# Altium schematic sheet Sen_Cos_Acondicionation.SchDoc
size 431 x 279 mm; Organization: ORGANIZATION; Address1: ADDRESS 1; Address2: ADDRESS 2; Address3: ADDRESS 3; Address4: ADDRESS 4; Revision: -; SheetNumber: 16; SheetTotal: 16; ENG_APP_DATE: --/--/--; DSN_APP_DATE: --/--/--; CHK_APP_DATE: --/--/--
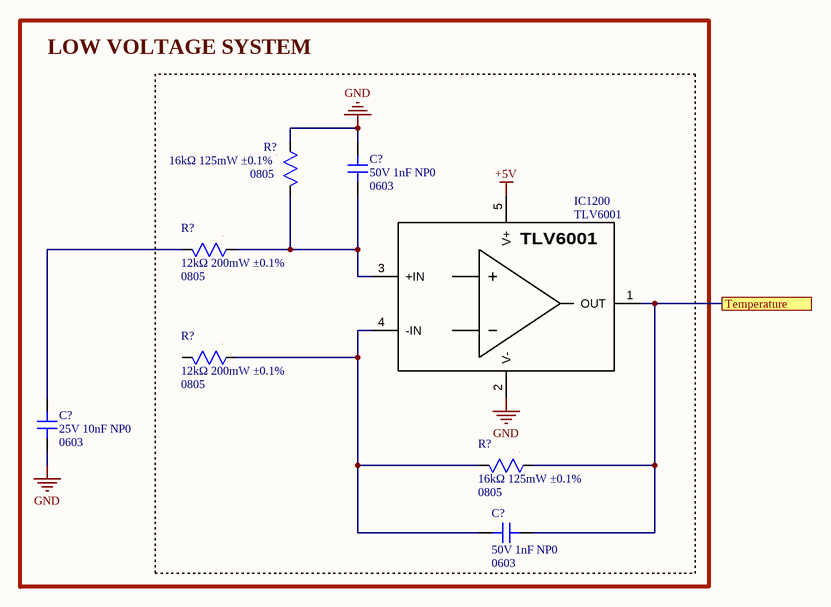
[diagram p0: Sen_Cos_Acondicionation.SchDoc]

## Parts
(Parts that share a designator on the sheet are numbered #1, #2 ... from top to bottom, then left to right.)
C?#1  value 50V 1nF NP0  Package: 0603  [CAP SMD 0603]  (hidden comment: CAP non polarized)
C?#2  value 25V 10nF NP0  Package: 0603  [CAP SMD 0603]  (hidden comment: CAP non polarized)
C?#3  value 50V 1nF NP0  Package: 0603  [CAP SMD 0603]  (hidden comment: CAP non polarized)
IC1200  TLV6001  [SOT-23-5]
R?#1  value 16kΩ 125mW ±0.1%  Package: 0805  [RES SMD 0805]  (hidden comment: RES)
R?#2  value 12kΩ 200mW ±0.1%  Package: 0805  [RES SMD 0805]  (hidden comment: RES)
R?#3  value 12kΩ 200mW ±0.1%  Package: 0805  [RES SMD 0805]  (hidden comment: RES)
R?#4  value 16kΩ 125mW ±0.1%  Package: 0805  [RES SMD 0805]  (hidden comment: RES)

## Blocks framed on the sheet
LOW VOLTAGE SYSTEM: C?#1-C?#3 IC1200 R?#1-R?#4

## Ports
Temperature

## Nets
+5V: IC1200.5(V+)
GND: C?#1.2 C?#2.2 IC1200.2(V-) R?#1.1
Temperature: C?#3.2 IC1200.1(OUT) R?#4.1 ; port Temperature
NetC?#1_1: C?#1.1 IC1200.3(+IN) R?#1.2 R?#2.1
NetC?#2_1: C?#2.1 R?#2.2
NetC?#3_1: C?#3.1 IC1200.4(-IN) R?#3.1 R?#4.2

Not connected (* = marked no-connect by the designer): R?#3 2

## Notes on the sheet
- DWG. NO.
- REV.
- SHT.
- THIS DOCUMENT AND THE DATA DISCLOSED HEREIN OR HEREWITH IS THE PROPERTY OF ALTIUM LIMITED AND MAY BE FREELY DISTRIBUTED IN WHOLE. NO RIGHTS ARE RESERVED OR EXPRESS OR IMPLIED WARANTEE GIVEN.
- REVISION
- DESCRIPTION
- DATE
- APPROVED
- ENG:
- APPROVALS
- PROJECT
- DSN:
- CHK:
- REFERENCE DOCUMENTS
- PROJECT REVISION:
- TITLE
- DOCUMENT REVISION:
- DESIGN ITEM:
- BOM:
- FAB DWG:
- PCB DWG:
- ASSY DWG:
- SCALE:
- SIZE
- B
- CAGE CODE
- FILE NAME
- DWG NO.
- SHEET
- OF
- REV

## Library data of the parts
C?#1 C?#3 = 001-0127: Condensadores de cerámica multicapa (MLCC- SMD/SMT) WCAP-CSGP 1000pF 0603 5% 50V MLCC; MPN: 885012006063; Manufacturer: Wurth Elektronik; ComponentLink1Description: Datasheet; ComponentLink1URL: https://www.we-online.com/components/products/datasheet/885012006063.pdf; ComponentLink2Description: Distributor Link; ComponentLink2URL: https://www.mouser.es/ProductDetail/Wurth-Elektronik/885012006063?qs=0KOYDY2FL29yUmMQmcJrdA%3D%3D; ID: 001-0127; Distributor PN: 710-885012006063; Distributor: Mouser
C?#2 = 001-0109: Condensadores de cerámica multicapa (MLCC- SMD/SMT) 50V 5100pF 0603 C0G 1%; MPN: C0603C512F5GACTU; Manufacturer: KEMET; ComponentLink1Description: Datasheet; ComponentLink1URL: https://www.mouser.es/datasheet/3/72/1/C0603C512F5GACTU.pdf; ComponentLink2Description: Distributor Link; ComponentLink2URL: https://www.mouser.es/ProductDetail/KEMET/C0603C512F5GACTU?qs=Fn3VdHBzkcmgqbeAGPfrXg%3D%3D; ID: 001-0109; Distributor PN: 80-C0603C512F5G; Distributor: Mouser
IC1200 = 062-0002: Amplificadores operacionales - Op Amps Single 5.5-V 1-MHz R RIO operational a A A 595-TLV6001UIDBVT; MPN: TLV6001UIDBVR; Manufacturer: Texas Instruments; ID: 062-0002; ComponentLink1URL: https://www.ti.com/lit/ds/symlink/tlv6001.pdf?ts=1781607824916&ref_url=https%253A%252F%252Fcz.mouser.com%252F; ComponentLink2URL: https://www.mouser.es/ProductDetail/Texas-Instruments/TLV6001UIDBVR?qs=8N88piwwHEgntIgM8jjJ5Q%3D%3D; Value: -; Package: SOT-23-5; Distributor PN: 595-TLV6001UIDBVR; Distributor: Mouser
R?#1 R?#4 = 010-0184: Resistores de película fina - SMD 0805 16Kohm 0.1% 10ppm AEC-Q200; MPN: ERA-6ARB163V; Manufacturer: Panasonic; ComponentLink1Description: Datasheet; ComponentLink1URL: https://industrial.panasonic.com/cdbs/www-data/pdf/RDM0000/AOA0000C307.pdf; ComponentLink2Description: Distributor Link; ComponentLink2URL: https://www.mouser.es/ProductDetail/Panasonic/ERA-6ARB163V?qs=sGAEpiMZZMtlubZbdhIBIJiMSTY83nT4nukUMCYb38k%3D; ID: 010-0184; Distributor PN: 667-ERA-6ARB163V; Distributor: Mouser
R?#2 R?#3 = 010-0186: Resistores de película fina - SMD RQ 0805 12K1 0.1% 10PPM 5K RL; MPN: RQ73C2A12K1BTD; Manufacturer: TE Connectivity / Holsworthy; ComponentLink1Description: Datasheet; ComponentLink1URL: https://www.te.com/en/product-9-2176380-9.html; ComponentLink2Description: Distributor Link; ComponentLink2URL: https://www.mouser.es/ProductDetail/TE-Connectivity-Holsworthy/RQ73C2A12K1BTD?qs=gZXFycFWdAO8owZcKCpcmw%3D%3D; ID: 010-0186; Distributor PN: 279-RQ73C2A12K1BTD; Distributor: Mouser